# Altium schematic sheet Разъем программирования.SchDoc
size 209 x 297 mm; Scale: 1:1; DocumentType: Схема электрическая принципиальная; FirstReferrence: АБВГ.123456.001
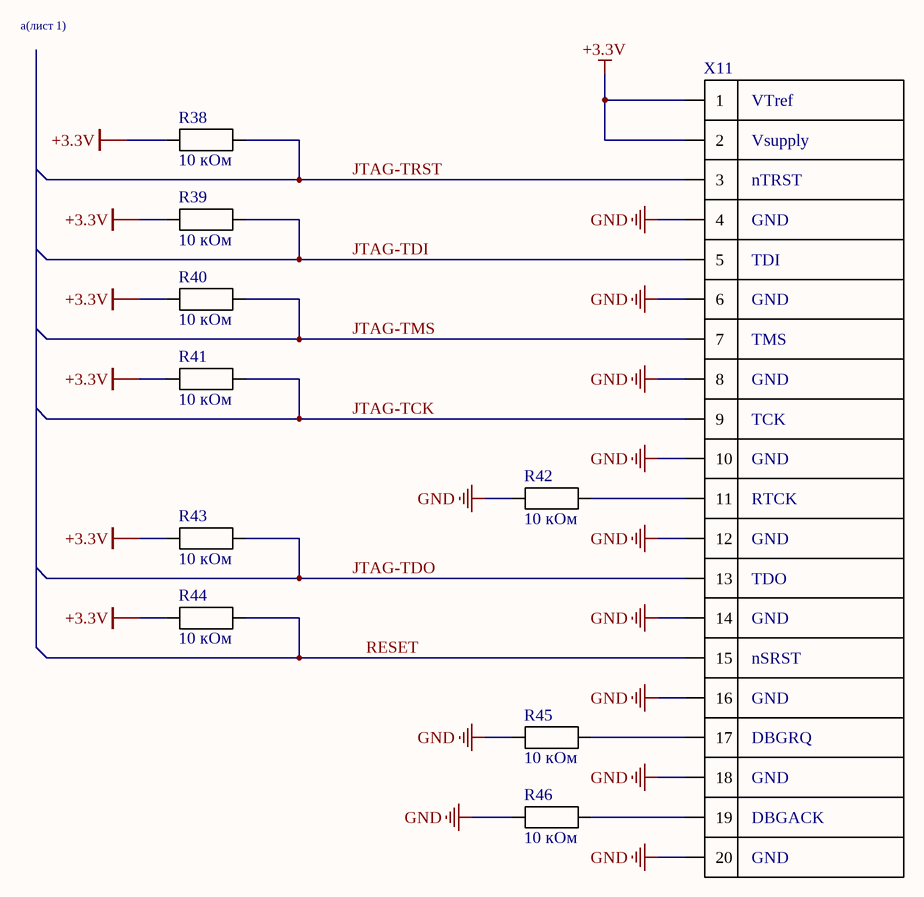
[diagram p0: Разъем программирования.SchDoc]

## Parts
R38  10 кОм  [Р1-12-0,125]
R39  10 кОм  [Р1-12-0,125]
R40  10 кОм  [Р1-12-0,125]
R41  10 кОм  [Р1-12-0,125]
R42  10 кОм  [Р1-12-0,125]
R43  10 кОм  [Р1-12-0,125]
R44  10 кОм  [Р1-12-0,125]
R45  10 кОм  [Р1-12-0,125]
R46  10 кОм  [Р1-12-0,125]
X11  (no value)  [IDC20MS]

## Nets
+3.3V: R38.1 R39.1 R40.1 R41.1 R43.1 R44.1 X11.1 X11.2
GND: R42.1 R45.1 R46.1 X11.4 X11.6 X11.8 X11.10 X11.12 X11.14 X11.16 X11.18 X11.20
JTAG-TCK: R41.2 X11.9
JTAG-TDI: R39.2 X11.5
JTAG-TDO: R43.2 X11.13
JTAG-TMS: R40.2 X11.7
JTAG-TRST: R38.2 X11.3
RESET: R44.2 X11.15
NetR42_2: R42.2 X11.11
NetR45_2: R45.2 X11.17
NetR46_2: R46.2 X11.19

## Notes on the sheet
- а(лист 1)
- Перв. примен.
- Справ. №
- Подп. и дата
- Инв. № дубл.
- Взам. инв. №
- Разраб.
- Изм.
- Лист
- № докум.
- Подп.
- Дата
- Лит.
- Масса
- Масштаб
- Пров.
- Т.контр.
- Листов
- Инв. № подл.
- Утв.
- Н.контр.
- 2.106-A4
- Копировал
- Формат А4
- (in symbol SAM_ICE_RUS_20) VTref; Vsupply; nTRST; GND; TDI; TMS; TCK; RTCK; TDO; nSRST; DBGRQ; DBGACK

## Library data of the parts
R38-R46 = Р1-12-0,125-10,0 кОм±1%: PartNumber: АЛЯР.434110.005 ТУ; ManufacturerPartNumber: Р1-12-0,125-10,0 кОм±1%-Л; Tolerance: ±1%-Л; Power/Voltage: 0,125; Value: 10 кОм; Category: Резистор
X11 = SAM_ICE_RUS_20: PartNumber: РЮМК.430420.033 ТУ; ManufacturerPartNumber: Вилка СНП394-20ВП21-2; Category: Соединитель